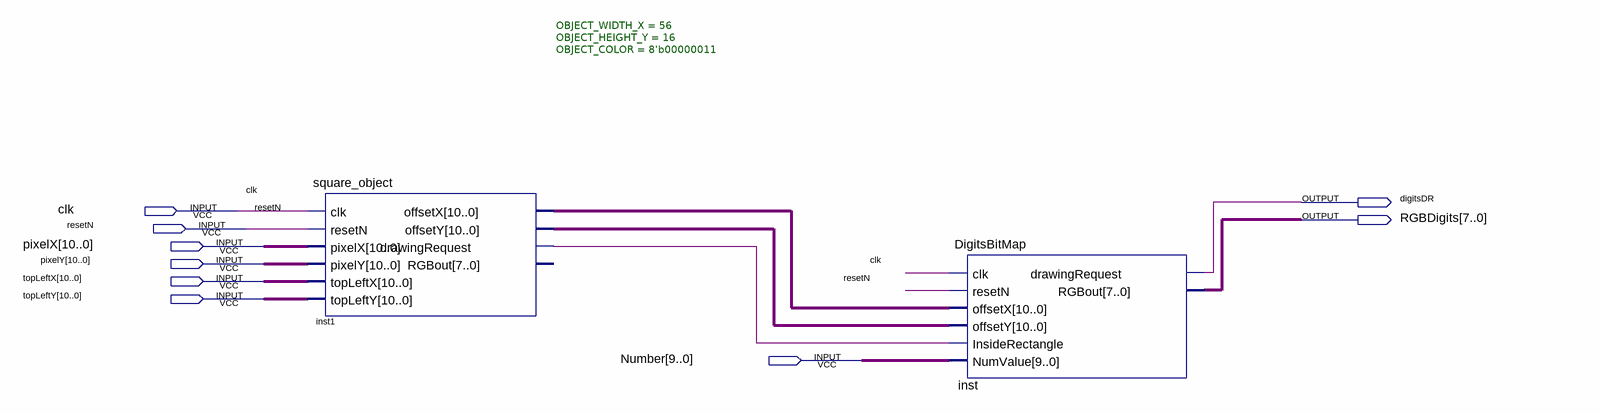
[diagram p0: schematic sheet]
// Quartus schematic DigitsBlock.bdf as structural Verilog: 2 symbols, 9 pins
module DigitsBlock (
  input  clk,
  input  resetN,
  input  [10:0] pixelX,
  input  [10:0] pixelY,
  input  [10:0] topLeftX,
  input  [10:0] topLeftY,
  input  [9:0] Number,
  output digitsDR,
  output [7:0] RGBDigits
);

  wire inst1_drawingrequest;
  wire [10:0] inst1_offsetx, inst1_offsety;

  square_object #(.OBJECT_WIDTH_X(56), .OBJECT_HEIGHT_Y(16), .OBJECT_COLOR(8'b00000011)) inst1 (
    .clk(clk), .resetN(resetN), .pixelX(pixelX), .pixelY(pixelY), .topLeftX(topLeftX), .topLeftY(topLeftY),
    .offsetX(inst1_offsetx), .offsetY(inst1_offsety), .drawingRequest(inst1_drawingrequest));  // open: RGBout
  DigitsBitMap inst (
    .clk(clk), .resetN(resetN), .offsetX(inst1_offsetx), .offsetY(inst1_offsety),
    .InsideRectangle(inst1_drawingrequest), .NumValue(Number), .drawingRequest(digitsDR), .RGBout(RGBDigits));
endmodule
